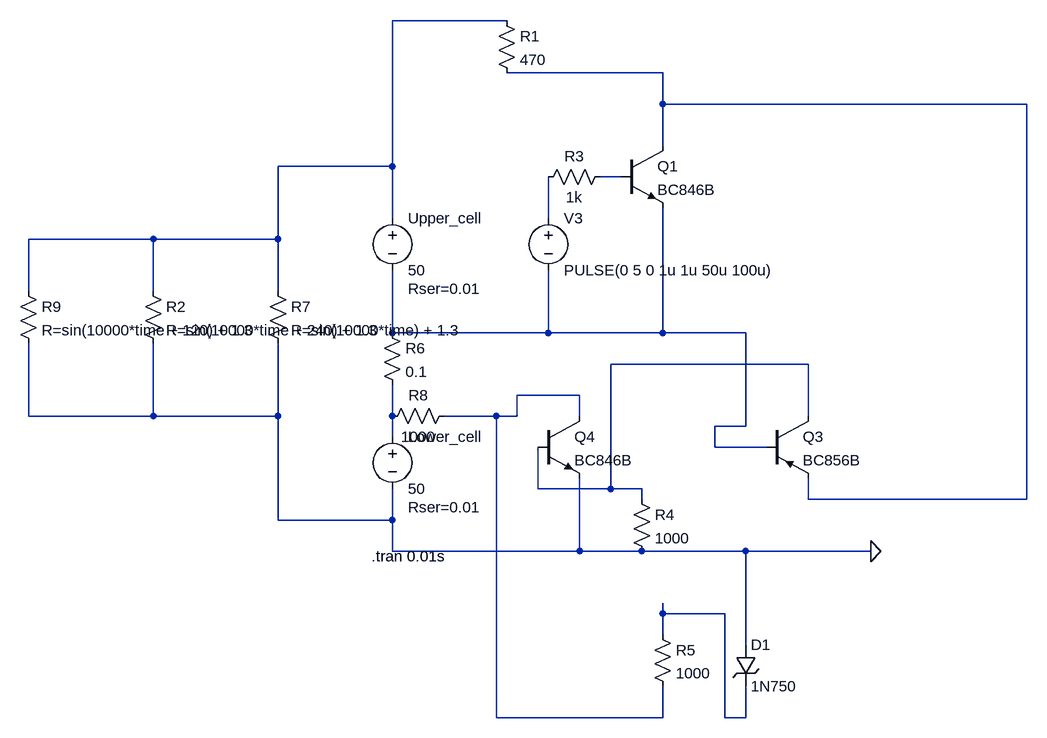
[diagram p0: schematic BMSDataLevelShift.asc]
BMSDataLevelShift.asc, the LTspice schematic file:
Version 4
SHEET 1 1012 884
WIRE 208 -192 32 -192
WIRE 448 -112 208 -112
WIRE 448 -64 448 -112
WIRE 1008 -64 448 -64
WIRE 448 0 448 -64
WIRE 32 32 32 -192
WIRE 32 32 -144 32
WIRE 384 48 352 48
WIRE 32 112 32 32
WIRE 272 112 272 48
WIRE -336 144 -528 144
WIRE -144 144 -144 32
WIRE -144 144 -336 144
WIRE -528 224 -528 144
WIRE -336 224 -336 144
WIRE -144 224 -144 144
WIRE 32 288 32 192
WIRE 272 288 272 192
WIRE 272 288 32 288
WIRE 448 288 448 96
WIRE 448 288 272 288
WIRE 576 288 448 288
WIRE 672 336 368 336
WIRE 320 384 224 384
WIRE -528 416 -528 304
WIRE -336 416 -336 304
WIRE -336 416 -528 416
WIRE -144 416 -144 304
WIRE -144 416 -336 416
WIRE 32 416 32 368
WIRE 192 416 112 416
WIRE 224 416 224 384
WIRE 224 416 192 416
WIRE 320 416 320 384
WIRE 672 416 672 336
WIRE 576 432 576 288
WIRE 576 432 528 432
WIRE 32 448 32 416
WIRE 528 464 528 432
WIRE 608 464 528 464
WIRE 256 528 256 464
WIRE 368 528 368 336
WIRE 368 528 256 528
WIRE 416 528 368 528
WIRE 416 544 416 528
WIRE 672 544 672 512
WIRE 1008 544 1008 -64
WIRE 1008 544 672 544
WIRE -144 576 -144 416
WIRE 32 576 32 528
WIRE 32 576 -144 576
WIRE 32 624 32 576
WIRE 320 624 320 512
WIRE 320 624 32 624
WIRE 416 624 320 624
WIRE 576 624 416 624
WIRE 768 624 576 624
WIRE 448 720 448 704
WIRE 544 720 448 720
WIRE 448 752 448 720
WIRE 576 768 576 624
WIRE 192 880 192 416
WIRE 448 880 448 832
WIRE 448 880 192 880
WIRE 544 880 544 720
WIRE 576 880 576 832
WIRE 576 880 544 880
FLAG 768 624 0
SYMBOL voltage 32 96 R0
WINDOW 123 0 0 Left 0
WINDOW 39 24 124 Left 2
SYMATTR SpiceLine Rser=0.01
SYMATTR InstName Upper_cell
SYMATTR Value 50
SYMBOL npn 384 0 R0
SYMATTR InstName Q1
SYMATTR Value BC846B
SYMBOL res 192 -208 R0
SYMATTR InstName R1
SYMATTR Value 470
SYMATTR SpiceLine tol=1 pwr=0.25
SYMBOL voltage 32 432 R0
WINDOW 123 0 0 Left 0
WINDOW 39 24 124 Left 2
SYMATTR SpiceLine Rser=0.01
SYMATTR InstName Lower_cell
SYMATTR Value 50
SYMBOL voltage 272 96 R0
WINDOW 123 24 124 Left 2
WINDOW 39 0 0 Left 0
SYMATTR InstName V3
SYMATTR Value PULSE(0 5 0 1u 1u 50u 100u)
SYMBOL res 368 32 R90
WINDOW 0 0 56 VBottom 2
WINDOW 3 32 56 VTop 2
SYMATTR InstName R3
SYMATTR Value 1k
SYMATTR SpiceLine tol=1 pwr=0.25
SYMBOL pnp 608 416 R0
SYMATTR InstName Q3
SYMATTR Value BC856B
SYMBOL res 400 528 R0
SYMATTR InstName R4
SYMATTR Value 1000
SYMATTR SpiceLine tol=1 pwr=0.25
SYMBOL res 432 736 R0
SYMATTR InstName R5
SYMATTR Value 1000
SYMATTR SpiceLine tol=1 pwr=0.25
SYMBOL zener 560 768 R0
SYMATTR InstName D1
SYMATTR Value 1N750
SYMBOL res 16 272 R0
SYMATTR InstName R6
SYMATTR Value 0.1
SYMBOL res -160 208 R0
SYMATTR InstName R7
SYMATTR Value R=sin(10000*time) + 1.3
SYMBOL res 128 400 R90
WINDOW 0 0 56 VBottom 2
WINDOW 3 32 56 VTop 2
SYMATTR InstName R8
SYMATTR Value 1000
SYMATTR SpiceLine tol=1 pwr=0.25
SYMBOL npn 256 416 R0
SYMATTR InstName Q4
SYMATTR Value BC846B
SYMBOL res -352 208 R0
SYMATTR InstName R2
SYMATTR Value R=sin(10000*time + 240) + 1.3
SYMBOL res -544 208 R0
SYMATTR InstName R9
SYMATTR Value R=sin(10000*time + 120) + 1.3
TEXT 0 632 Left 2 !.tran 0.01s

The netlist it stands for:
* BMSDataLevelShift.asc
V§Upper_cell N001 N005 50 Rser=0.01
Q1 N002 N003 N005 0 BC846B
R1 N001 N002 470 tol=1 pwr=0.25
V§Lower_cell N008 0 50 Rser=0.01
V3 N004 N005 PULSE(0 5 0 1u 1u 50u 100u)
R3 N003 N004 1k tol=1 pwr=0.25
Q3 N006 N005 N002 0 BC856B
R4 N006 0 1000 tol=1 pwr=0.25
R5 N009 N007 1000 tol=1 pwr=0.25
D1 0 N009 1N750
R6 N005 N008 0.1
R7 N001 0 R=sin(10000*time) + 1.3
R8 N007 N008 1000 tol=1 pwr=0.25
Q4 N007 N006 0 0 BC846B
R2 N001 0 R=sin(10000*time + 240) + 1.3
R9 N001 0 R=sin(10000*time + 120) + 1.3
.model D D
.lib standard.dio
.model NPN NPN
.model PNP PNP
.lib standard.bjt
.tran 0.01s
.backanno
.end